# EAGLE design MSP430G2553-BB (EAGLE 7.6.0)
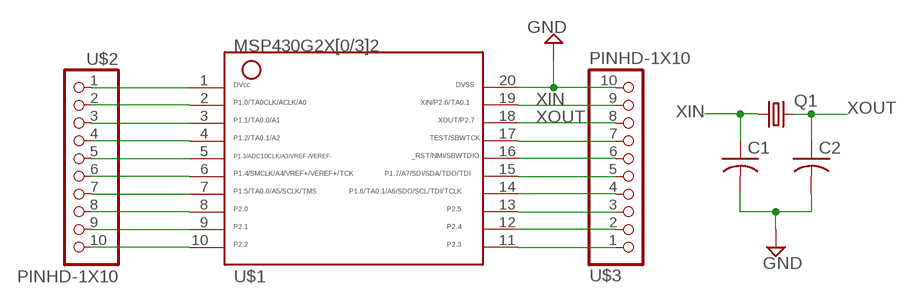
[diagram p0: schematic, sheet 1]

## Parts
C1  C-USC0402  [C0402]
C2  C-USC0402  [C0402]
Q1  CRYSTALHC49S  [HC49/S]
U$1  G2X[0/3]2---PW20  [PW20]
U$2  PINHD-1X10  [1X10-BIG]
U$3  PINHD-1X10  [1X10-BIG]

## Nets
GND: C1.2 C2.2 U$1.20 U$3.10
N$2: U$1.2 U$2.2
N$3: U$1.3 U$2.3
N$4: U$1.4 U$2.4
N$5: U$1.5 U$2.5
N$6: U$1.6 U$2.6
N$7: U$1.7 U$2.7
N$8: U$1.8 U$2.8
N$9: U$1.9 U$2.9
N$10: U$1.10 U$2.10
N$11: U$1.11 U$3.1
N$12: U$1.12 U$3.2
N$13: U$1.13 U$3.3
N$14: U$1.14 U$3.4
N$15: U$1.15 U$3.5
N$16: U$1.16 U$3.6
N$17: U$1.17 U$3.7
VCC: U$1.1 U$2.1
XIN: C1.1 Q1.1 U$1.19 U$3.9
XOUT: C2.1 Q1.2 U$1.18 U$3.8

## Library data of the parts
C1 C2 = adafruit:C-US: CAPACITOR, American symbol
Q1 = adafruit:CRYSTAL: CRYSTAL; OC_FARNELL: 1667008; OC_NEWARK: unknown
U$1 = TI_MSP430_v16:G2X[0/3]2---PW20: MSP430G2X[0/3]2 MSP430G2x32, MSP430G2x02 TSSOP (PW) 20 Pin Package http://focus.ti.com/docs/prod/folders/print/msp430g2432.html
U$2 U$3 = adafruit:PINHD-1X10: Pin header 1x10 0.1" spacing With round pins

## Board
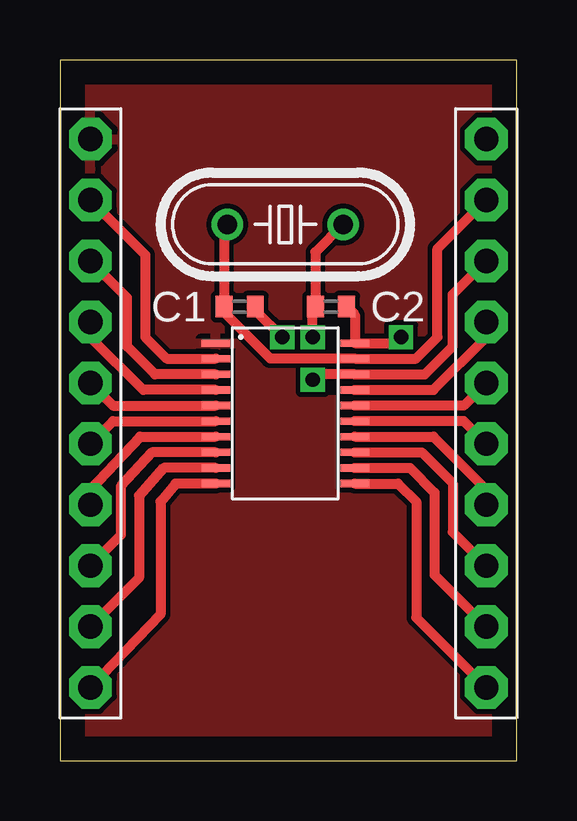
[diagram p1: board, top side]
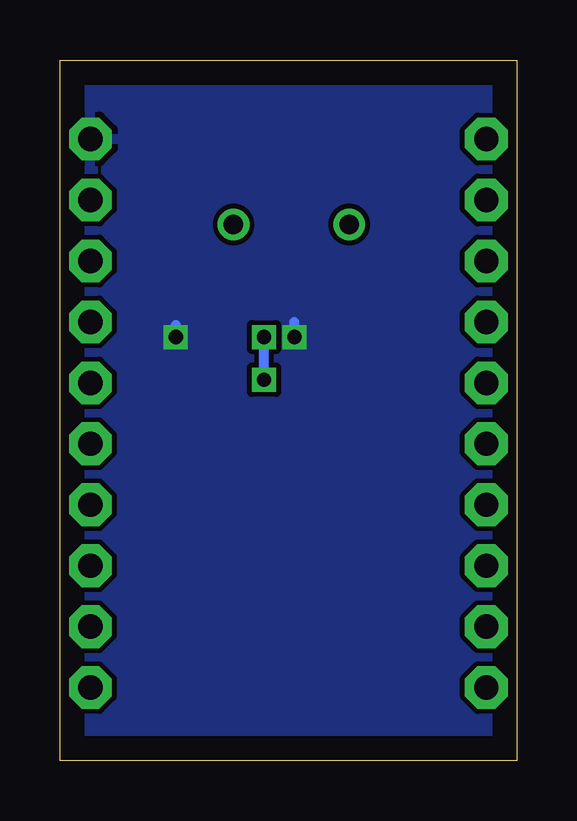
[diagram p2: board, bottom side, seen from below]

Size 19.05 x 29.2 mm. Coordinates in mm from the lower left corner, seen from the top.
Outline: 0,0 19.05,0 19.05,29.2 0,29.2 0,0
Copper layers (1*16): Top 0.035mm / dielectric 1.5mm / Bottom 0.035mm
Design rules "default": minimum track width 10mil, minimum drill 24mil, track to track 8mil, track to pad 8mil, pad to pad 8mil, via to via 8mil, smd to smd 8mil, copper to edge 40mil, drill to drill 8mil, minimum pad ring 10mil, minimum via ring 8mil, stop-mask expansion 4mil, vias tented up to drill 0mil, thermal gap 10mil

### Footprints (pad centres in the part's own frame; a part is rotated, then mirrored left to right if it is on the bottom)
C0402 = smd 0.7 x 0.9: 1 -0.65,0; 2 0.65,0
HC49/S = drill 0.813: 1 -2.413,0; 2 2.413,0
PW20 = smd 0.3 x 1.2: 1 -2.925,-2.9; 2 -2.275,-2.9; 3 -1.625,-2.9; 4 -0.975,-2.9; 5 -0.325,-2.9; 6 0.325,-2.9; 7 0.975,-2.9; 8 1.625,-2.9; 9 2.275,-2.9; 10 2.925,-2.9; 11 2.925,2.9; 12 2.275,2.9; 13 1.625,2.9; 14 0.975,2.9; 15 0.325,2.9; 16 -0.325,2.9; 17 -0.975,2.9; 18 -1.625,2.9; 19 -2.275,2.9; 20 -2.925,2.9
1X10-BIG = drill 1.016 pad 1.778 octagon: 1 -11.43,0; 2 -8.89,0; 3 -6.35,0; 4 -3.81,0; 5 -1.27,0; 6 1.27,0; 7 3.81,0; 8 6.35,0; 9 8.89,0; 10 11.43,0

### Placement (x,y rotation side)
C1  7.49,18.92 0 top
C2  11.3,18.92 0 top
Q1  9.4,22.35 0 top
U$1  9.4,14.48 270 top
U$2  1.27,14.48 270 top
U$3  17.78,14.48 90 top

### Tracks (layer width: path | path; a pad name or v marks a point on that pad's centre or on a via)
GND  (via drill 0.6)
  Top 0.406: v14.22,17.65 13.85,17.4 U$1.20 12.3,18.58 C2.2 | C1.2 8.14,18.78 v9.27,17.65
  Bottom 0.406: v14.22,17.65 14.22,18.16 | v9.27,17.65 9.27,18.29
  pour Bottom: -0.13,29.34 -0.13,-0.13 19.18,-0.13 19.18,29.34
N$2
  Top 0.406: U$2.2 3.56,21.08 3.56,17.65 4.46,16.75 U$1.2
N$3
  Top 0.406: U$1.3 3.96,16.1 2.79,17.27 2.79,19.3 U$2.3
N$4
  Top 0.406: U$1.4 3.47,15.45 1.27,17.65 U$2.4
N$5
  Top 0.406: U$2.5 2.21,14.8 U$1.5
N$6
  Top 0.406: U$2.6 2.21,14.15 U$1.6
N$7
  Top 0.406: U$1.7 3.34,13.5 1.27,11.3 U$2.7
N$8
  Top 0.406: U$1.8 3.84,12.85 2.54,11.43 2.54,9.4 U$2.8
N$9
  Top 0.406: U$1.9 4.33,12.2 3.3,11.05 3.3,7.62 U$2.9
N$10
  Top 0.406: U$1.10 4.82,11.55 4.19,10.79 4.19,6.1 U$2.10
N$11
  Top 0.406: U$1.11 14.1,11.55 14.86,10.79 14.86,5.97 U$3.1
N$12
  Top 0.406: U$1.12 14.59,12.2 15.62,11.18 15.62,7.75 U$3.2
N$13
  Top 0.406: U$1.13 15.09,12.85 16.38,11.56 16.38,9.53 U$3.3
N$14
  Top 0.406: U$1.14 15.58,13.5 17.78,11.3 U$3.4
N$15
  Top 0.406: U$3.5 16.84,14.15 U$1.15
N$16
  Top 0.406: U$3.6 16.84,14.8 U$1.16
N$17
  Top 0.406: U$1.17 15.58,15.45 17.78,17.65 U$3.7
VCC
  pour Top: -0.76,29.97 -0.76,-1.02 20.32,-1.02 20.19,29.97
XIN
  Top 0.406: U$3.9 15.75,21.34 15.75,17.65 14.85,16.75 U$1.19 12.29,16.76 8.76,16.76 6.84,18.68 C1.1 6.84,22.21 Q1.1
XOUT  (via drill 0.6)
  Top 0.406: U$3.8 16.38,19.43 16.38,17.27 15.21,16.1 U$1.18 10.77,16.1 v10.54,15.88 | Q1.2 10.65,21.19 C2.1 10.54,18.81 v10.54,17.65
  Bottom 0.406: v10.54,15.88 v10.54,17.65